# Altium schematic sheet Push-Pull_Inverter.SchDoc
size 1200 x 800 mm; SheetNumber: 1; SheetTotal: 1; SPICEModelCacheFSXMRDBX: <root> / <DocumentId>FSXMRDBX</DocumentId> / </root>
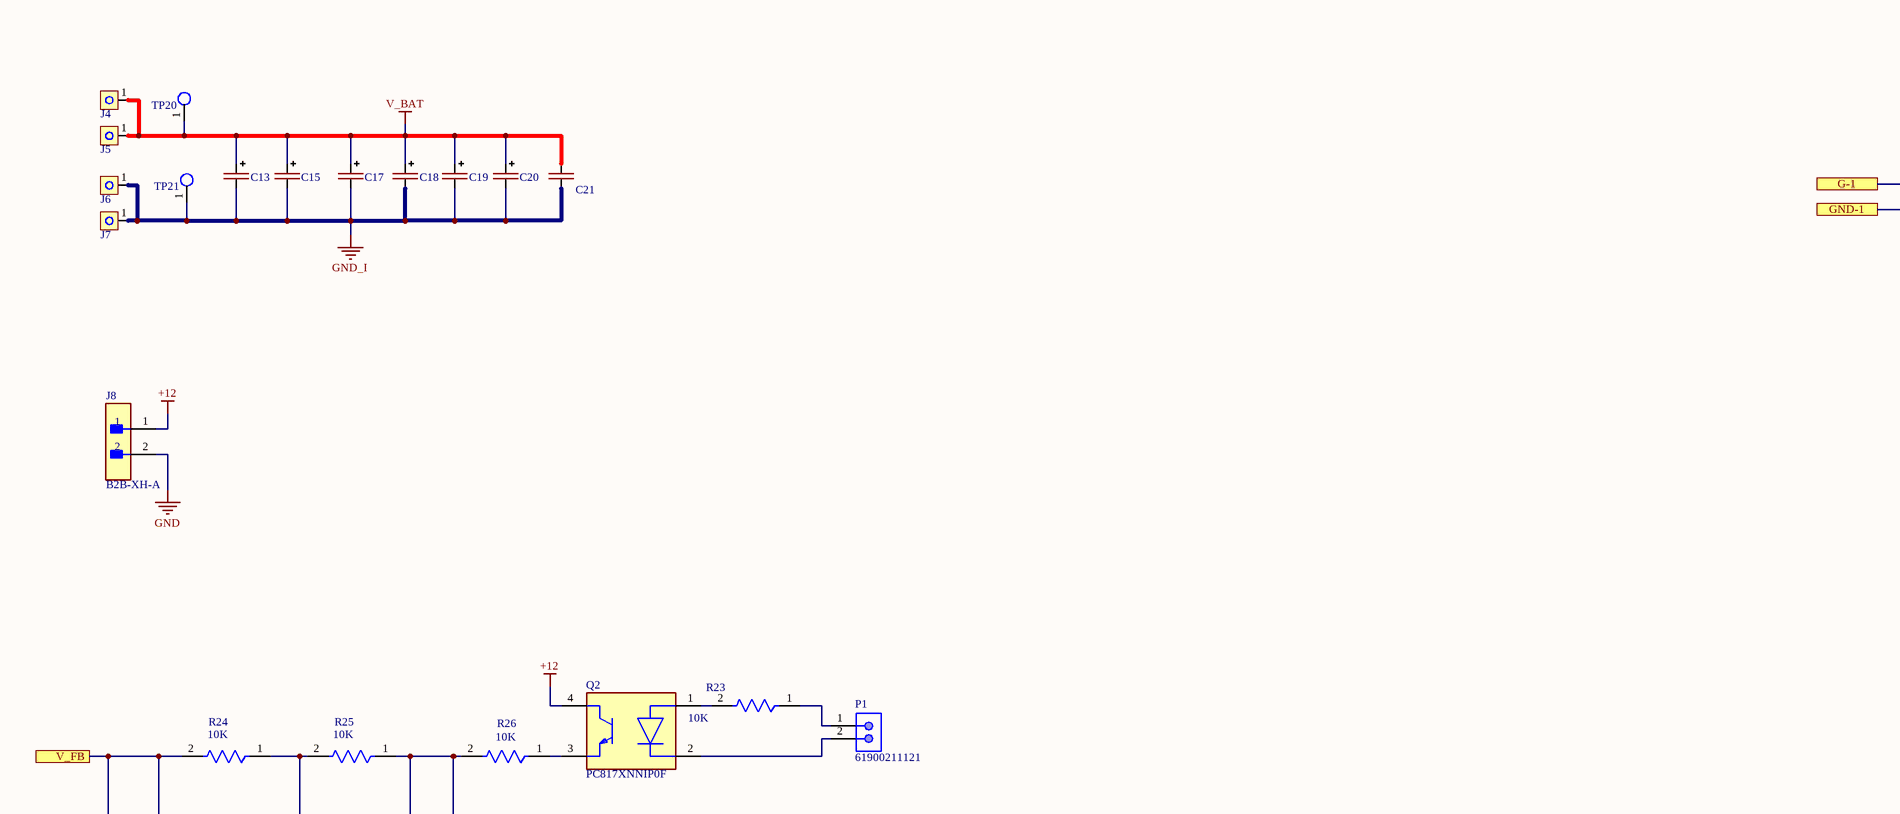
[diagram p0: Push-Pull_Inverter.SchDoc, top left]
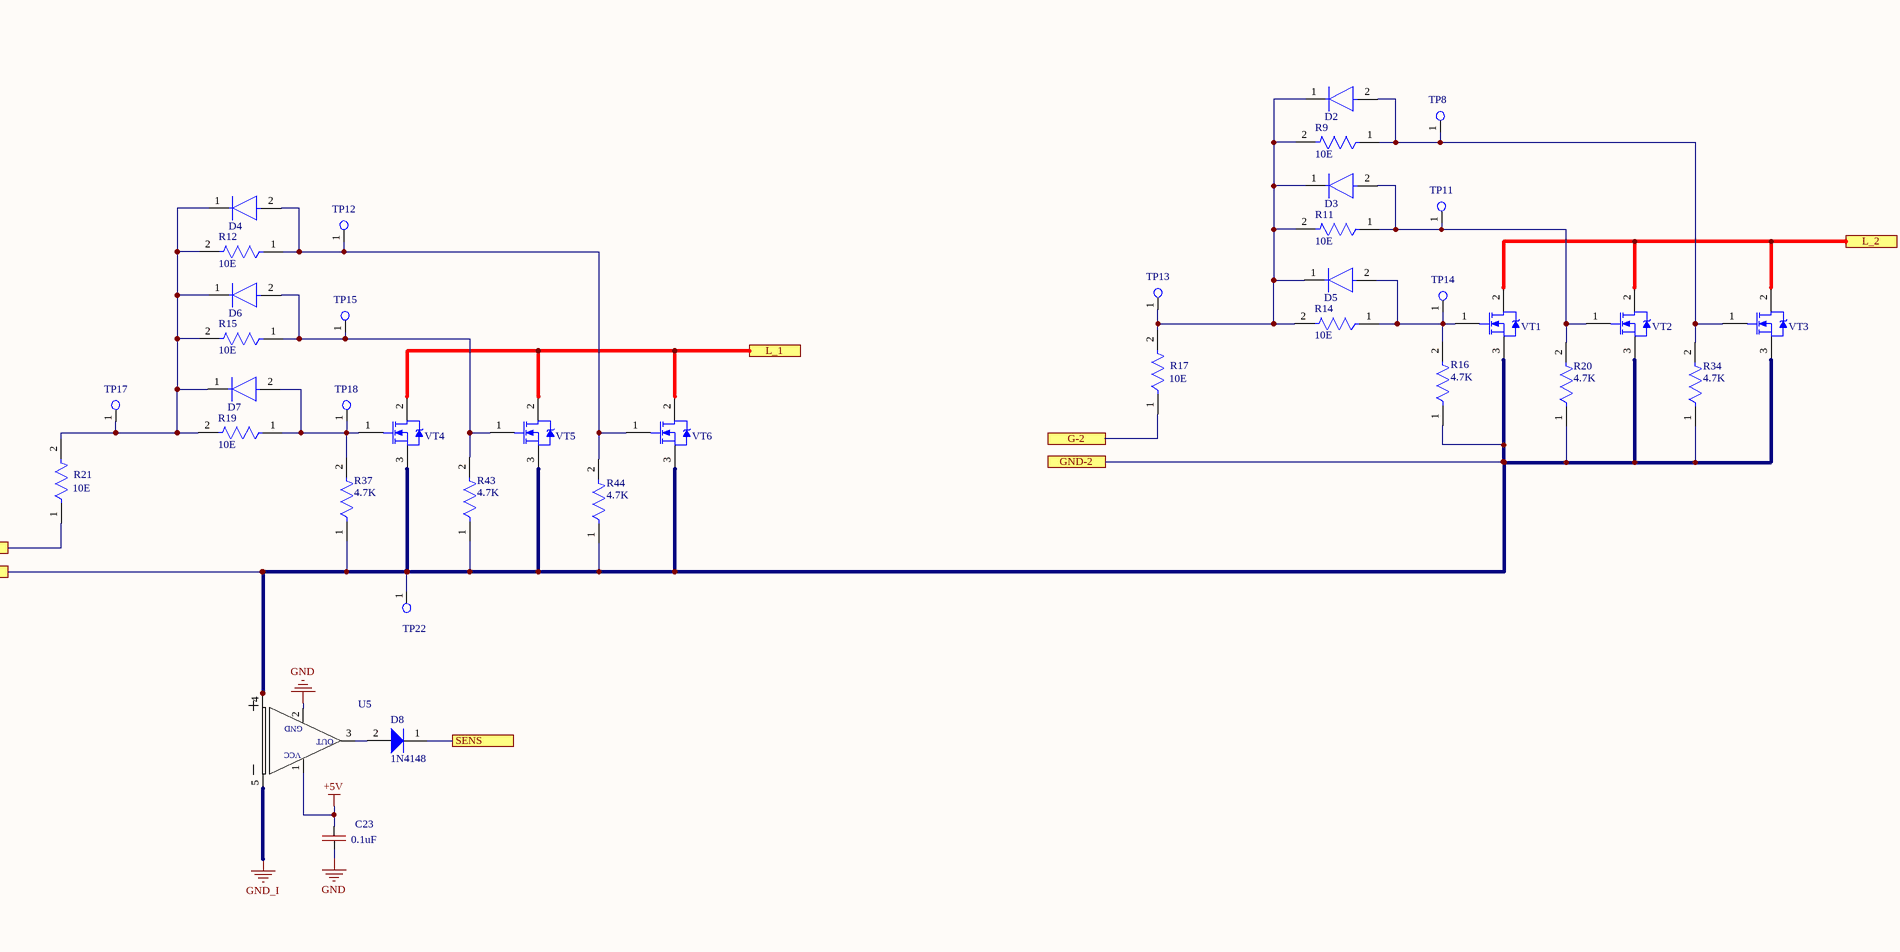
[diagram p1: Push-Pull_Inverter.SchDoc, top middle]
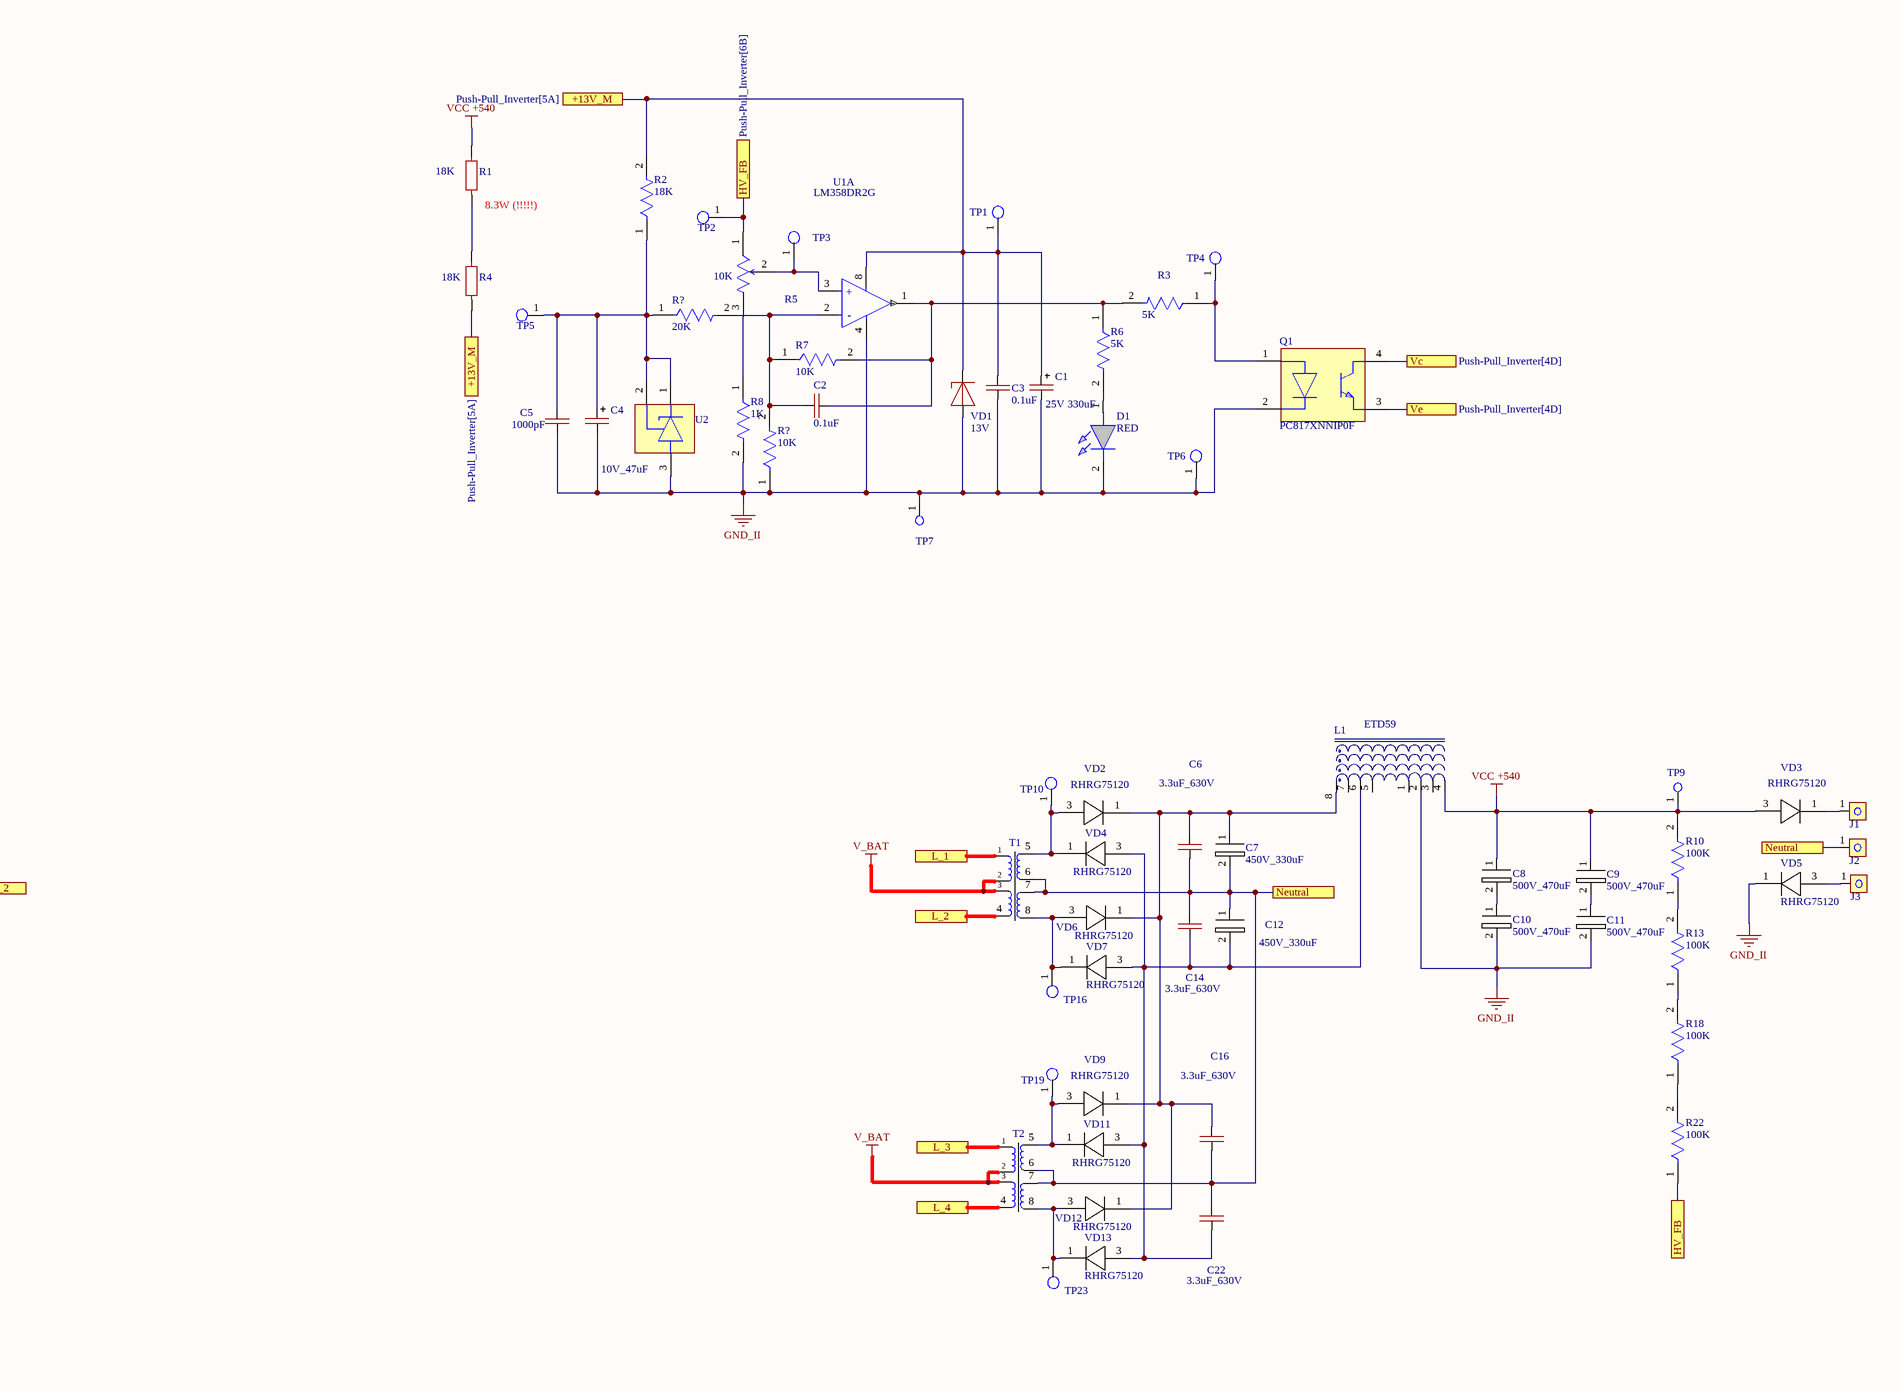
[diagram p2: Push-Pull_Inverter.SchDoc, top right]
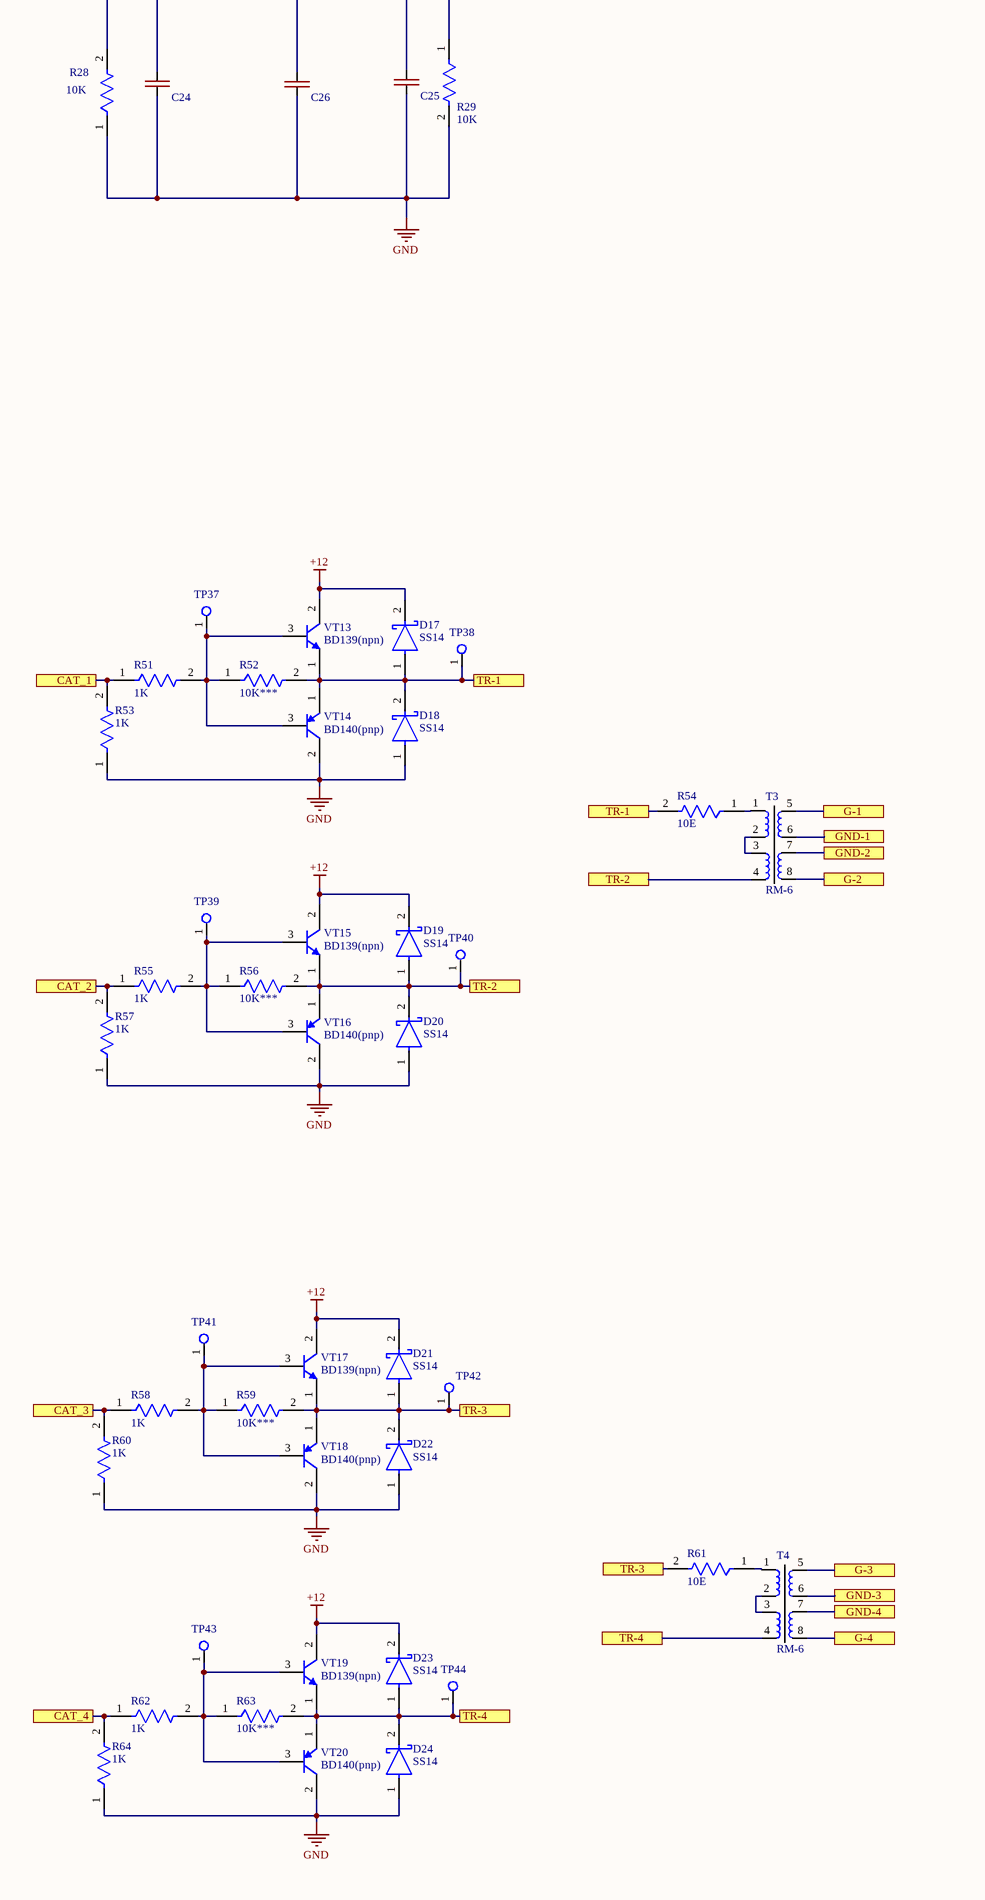
[diagram p3: Push-Pull_Inverter.SchDoc, bottom left]
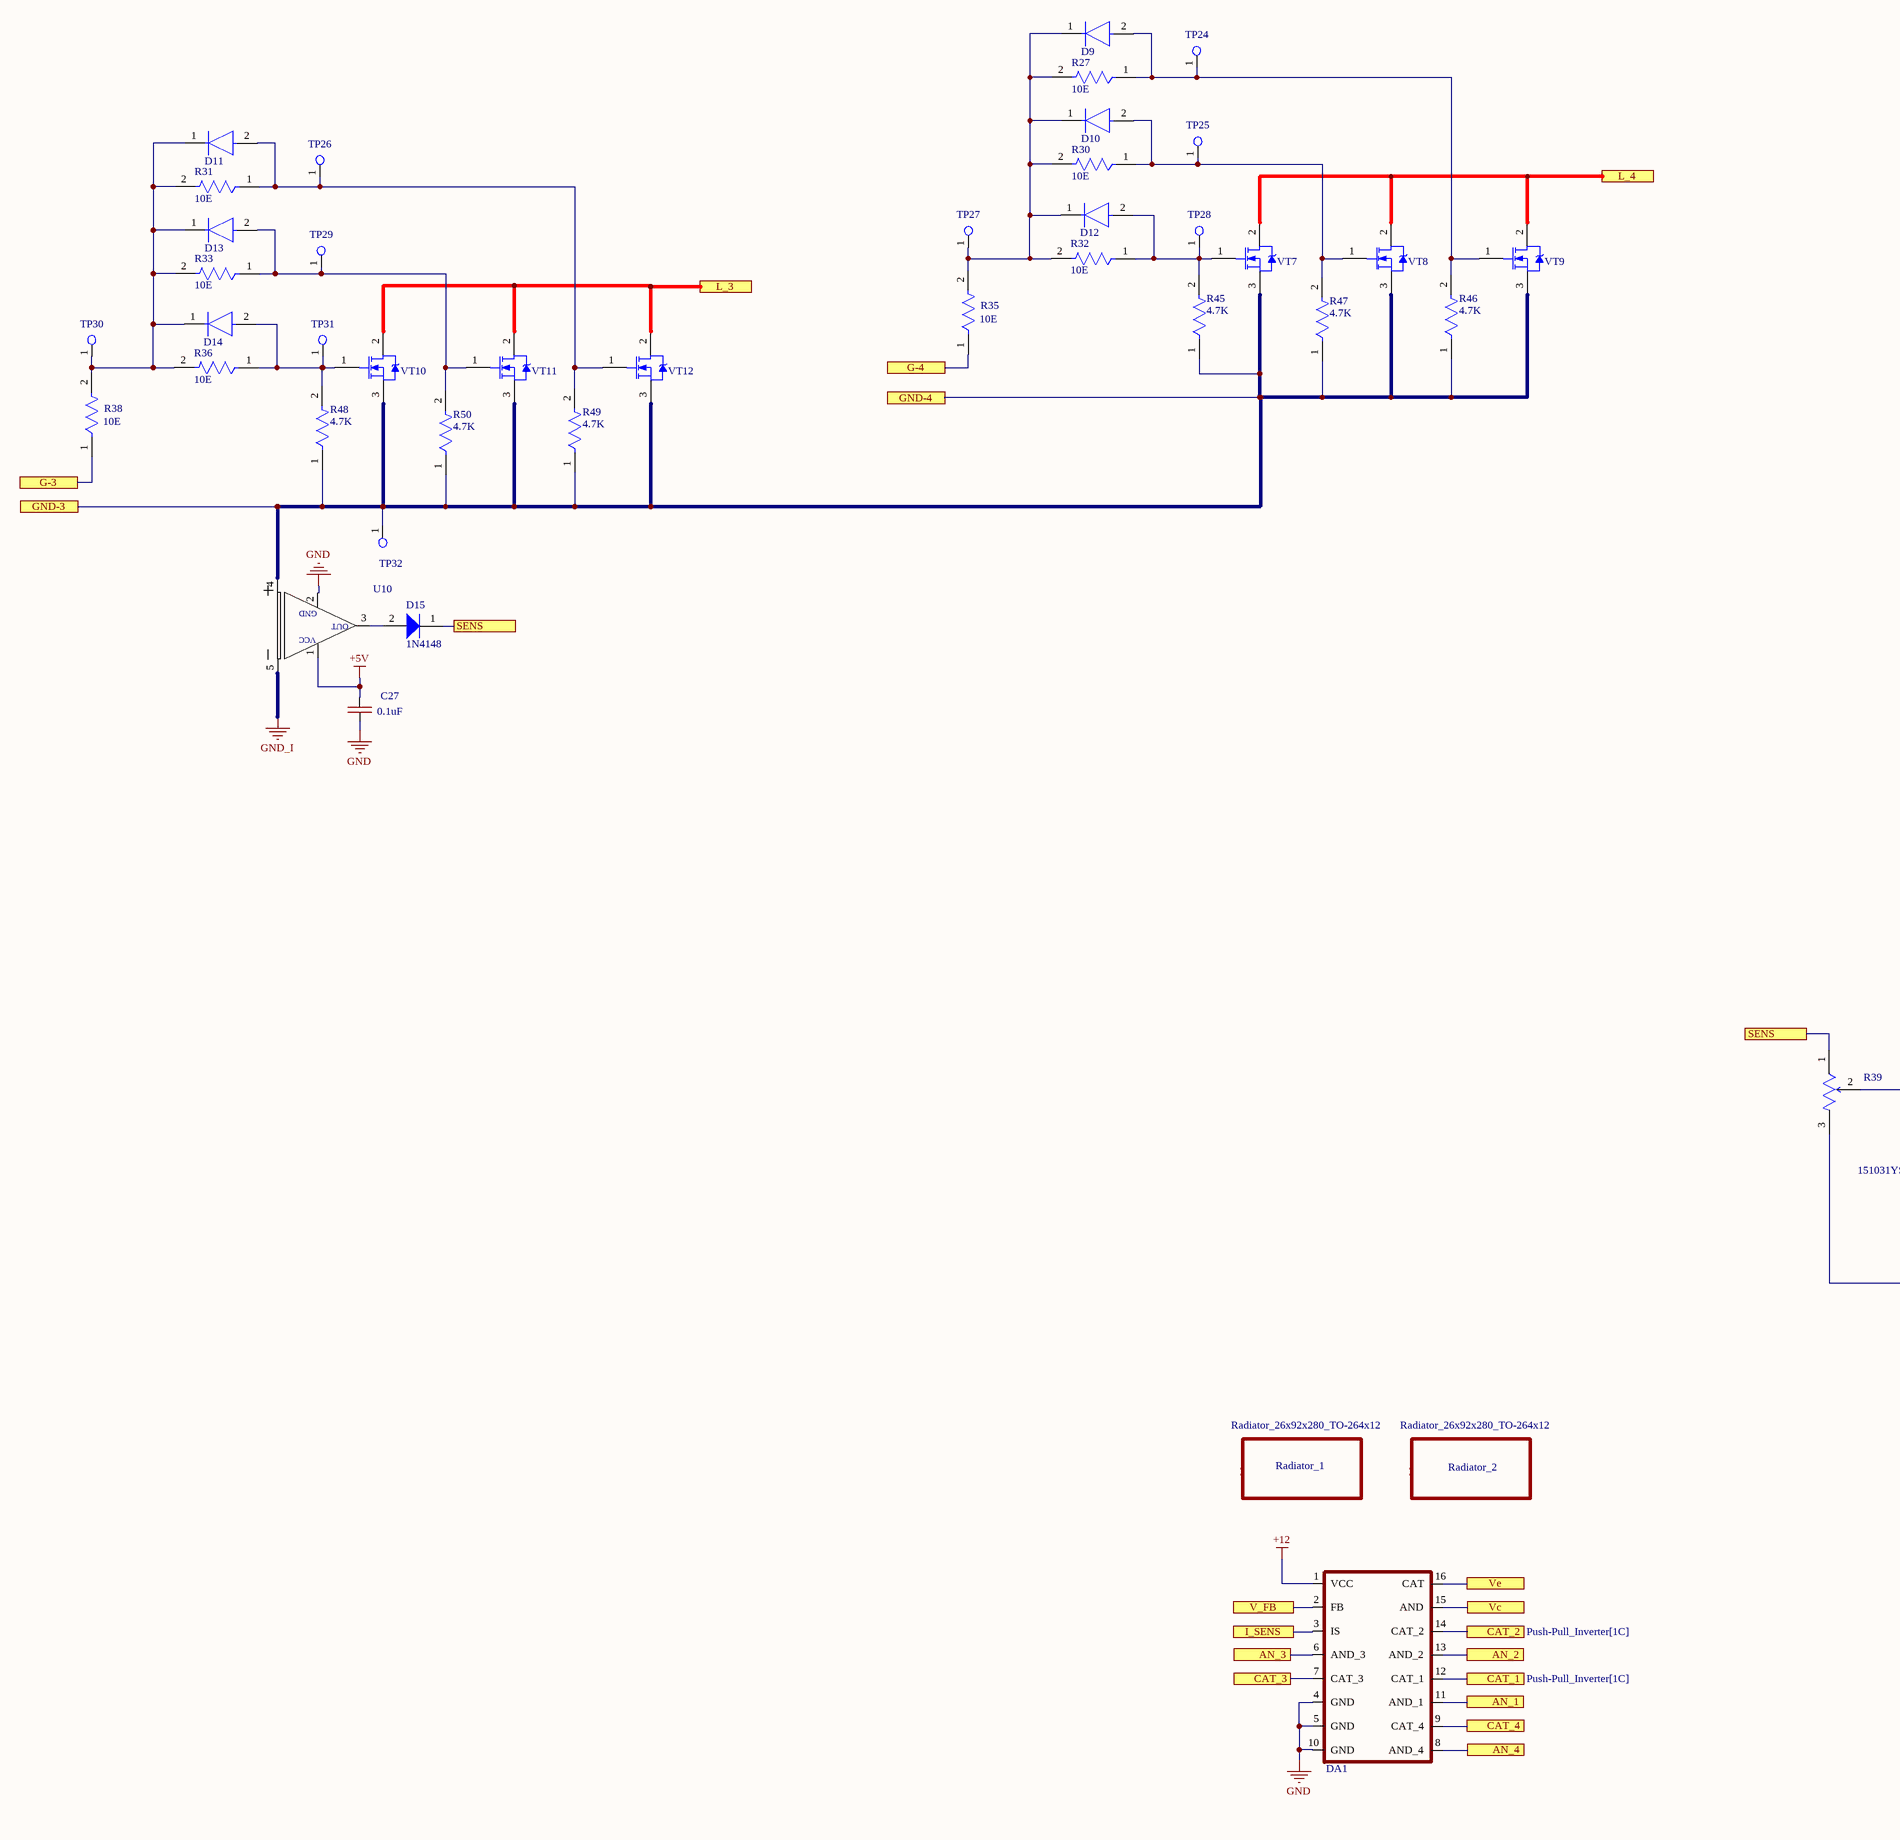
[diagram p4: Push-Pull_Inverter.SchDoc, bottom middle]
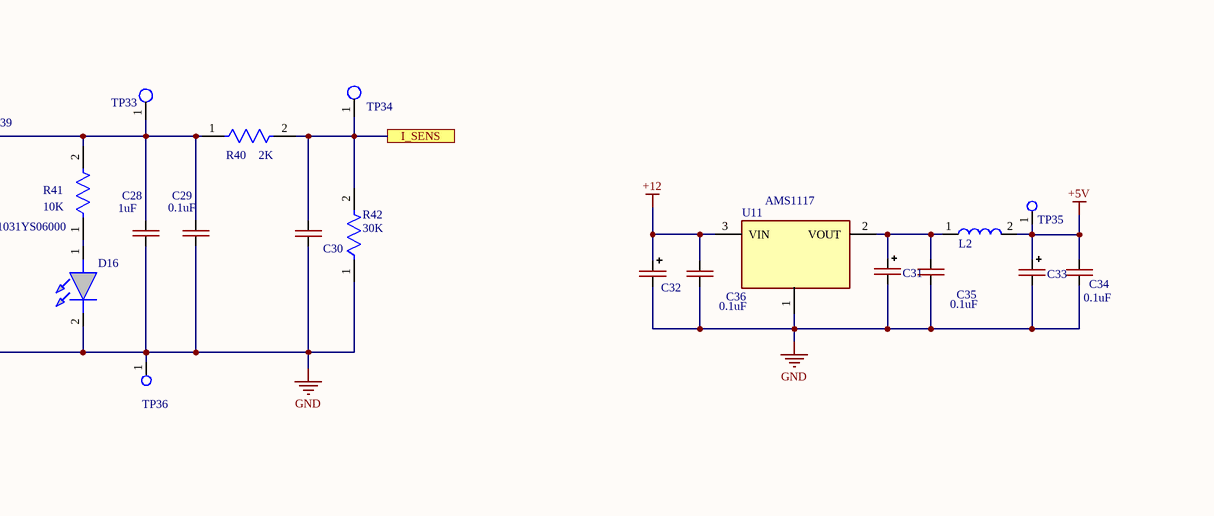
[diagram p5: Push-Pull_Inverter.SchDoc, bottom right]

## Parts
(Parts that share a designator on the sheet are numbered #1, #2 ... from top to bottom, then left to right.)
C1  25V 330uF  [CAP_SMD_Size_E]
C2  0.1uF  [CAP-0805]
C3  0.1uF  [CAP-0805]
C4  10V_47uF  [CAP-TAN-C]
C5  1000pF  [CAP-0805]
C6  3.3uF_630V  [CAP_4.7uF_630V]
C7  450V_330uF  [CAP_450V_330uF]
C8  500V_470uF  [CAP_450V_330uF]
C9  500V_470uF  [CAP_450V_330uF]
C10  500V_470uF  [CAP_450V_330uF]
C11  500V_470uF  [CAP_450V_330uF]
C12  450V_330uF  [CAP_450V_330uF]
C13  CAP-POLAR  [CAPPOL_35x60]  (value not drawn)
C14  3.3uF_630V  [CAP_4.7uF_630V]
C15  CAP-POLAR  [CAPPOL_35x60]  (value not drawn)
C16  3.3uF_630V  [CAP_4.7uF_630V]
C17  CAP-POLAR  [CAPPOL_35x60]  (value not drawn)
C18  CAP-POLAR  [CAPPOL_35x60]  (value not drawn)
C19  CAP-POLAR  [CAPPOL_35x60]  (value not drawn)
C20  CAP-POLAR  [CAPPOL_35x60]  (value not drawn)
C21  CAP-NON-POLAR  [CAP_1.5uf_400V]  (value not drawn)
C22  3.3uF_630V  [CAP_4.7uF_630V]
C23  0.1uF  [CAP-0805]
C24  CAP-NON-POLAR  [CAP-0805]  (value not drawn)
C25  CAP-NON-POLAR  [CAP-0805]  (value not drawn)
C26  CAP-NON-POLAR  [CAP-0805]  (value not drawn)
C27  0.1uF  [CAP-0805]
C28  1uF  [CAP-0805]
C29  0.1uF  [CAP-0805]
C30  CAP-NON-POLAR  [CAP-0805]  (value not drawn)
C31  CAP-POLAR  [CAP_SMD_Size_E]  (value not drawn)
C32  CAP-POLAR  [CAP_SMD_Size_E]  (value not drawn)
C33  CAP-POLAR  [CAP_SMD_Size_E]  (value not drawn)
C34  0.1uF  [CAP-0805]
C35  0.1uF  [CAP-0805]
C36  0.1uF  [CAP-0805]
D1  RED  [LED_RED]
D2  US1G  [DO-214AA]  (value not drawn)
D3  US1G  [DO-214AA]  (value not drawn)
D4  US1G  [DO-214AA]  (value not drawn)
D5  US1G  [DO-214AA]  (value not drawn)
D6  US1G  [DO-214AA]  (value not drawn)
D7  US1G  [DO-214AA]  (value not drawn)
D8  1N4148  [DIOD-SOD123-2_V]
D9  US1G  [DO-214AA]  (value not drawn)
D10  US1G  [DO-214AA]  (value not drawn)
D11  US1G  [DO-214AA]  (value not drawn)
D12  US1G  [DO-214AA]  (value not drawn)
D13  US1G  [DO-214AA]  (value not drawn)
D14  US1G  [DO-214AA]  (value not drawn)
D15  1N4148  [DIOD-SOD123-2_V]
D16  151031YS06000  [LED_RED]
D17  SS14  [DO-214-AC]
D18  SS14  [DO-214-AC]
D19  SS14  [DO-214-AC]
D20  SS14  [DO-214-AC]
D21  SS14  [DO-214-AC]
D22  SS14  [DO-214-AC]
D23  SS14  [DO-214-AC]
D24  SS14  [DO-214-AC]
DA1  PWM_Controller_Half_Bridge_ONLY_TL494  [PWM_Controller_Half_Bridge_ONLY_TL494]  (value not drawn)
J1  MG_136_HT  [Conn_MEIGAN_MG136HT]  (value not drawn)
J2  MG_136_HT  [Conn_MEIGAN_MG136HT]  (value not drawn)
J3  MG_136_HT  [Conn_MEIGAN_MG136HT]  (value not drawn)
J4  MG_136_HT  [Conn_MEIGAN_MG136HT]  (value not drawn)
J5  MG_136_HT  [Conn_MEIGAN_MG136HT]  (value not drawn)
J6  MG_136_HT  [Conn_MEIGAN_MG136HT]  (value not drawn)
J7  MG_136_HT  [Conn_MEIGAN_MG136HT]  (value not drawn)
J8  B2B-XH-A  [B2B-XH-A]
L1  ETD59  [Drossel]
L2  Coil  [Coil_4.5x4.5_mm]  (value not drawn)
P1  61900211121  [61900211121]
Q1  PC817XNNIP0F  [FP-PC817XNNIP0F-MFG]
Q2  PC817XNNIP0F  [FP-PC817XNNIP0F-MFG]
R1  18K  [RES_5W_VERT]
R2  18K  [RES-0805]
R3  5K  [RES-0805]
R4  18K  [RES_5W_VERT]
R5  10K  [RES_Adj_3296W_Bourns]
R6  5K  [RES-0805]
R7  10K  [RES-0805]
R8  1K  [RES-0805]
R9  10E  [RES_SMD_1210_IPC_A]
R10  100K  [RES-0805]
R11  10E  [RES_SMD_1210_IPC_A]
R12  10E  [RES_SMD_1210_IPC_A]
R13  100K  [RES-0805]
R14  10E  [RES_SMD_1210_IPC_A]
R15  10E  [RES_SMD_1210_IPC_A]
R16  4.7K  [RES-0805]
R17  10E  [RES_SMD_1210_IPC_A]
R18  100K  [RES-0805]
R19  10E  [RES_SMD_1210_IPC_A]
R20  4.7K  [RES-0805]
R21  10E  [RES_SMD_1210_IPC_A]
R22  100K  [RES-0805]
R23  10K  [RES-0805]
R24  10K  [RES-0805]
R25  10K  [RES-0805]
R26  10K  [RES-0805]
R27  10E  [RES_SMD_1210_IPC_A]
R28  10K  [RES-0805]
R29  10K  [RES-0805]
R30  10E  [RES_SMD_1210_IPC_A]
R31  10E  [RES_SMD_1210_IPC_A]
R32  10E  [RES_SMD_1210_IPC_A]
R33  10E  [RES_SMD_1210_IPC_A]
R34  4.7K  [RES-0805]
R35  10E  [RES_SMD_1210_IPC_A]
R36  10E  [RES_SMD_1210_IPC_A]
R37  4.7K  [RES-0805]
R38  10E  [RES_SMD_1210_IPC_A]
R39  10K  [RES_Adj_3296W_Bourns]  (value not drawn)
R40  2K  [RES-0805]
R41  10K  [RES-0805]
R42  30K  [RES-0805]
R43  4.7K  [RES-0805]
R44  4.7K  [RES-0805]
R45  4.7K  [RES-0805]
R46  4.7K  [RES-0805]
R47  4.7K  [RES-0805]
R48  4.7K  [RES-0805]
R49  4.7K  [RES-0805]
R50  4.7K  [RES-0805]
R51  1K  [RES-0805]
R52  10K***  [RES-0805]
R53  1K  [RES-0805]
R54  10E  [RES_SMD_1210_IPC_A]
R55  1K  [RES-0805]
R56  10K***  [RES-0805]
R57  1K  [RES-0805]
R58  1K  [RES-0805]
R59  10K***  [RES-0805]
R60  1K  [RES-0805]
R61  10E  [RES_SMD_1210_IPC_A]
R62  1K  [RES-0805]
R63  10K***  [RES-0805]
R64  1K  [RES-0805]
R?#1  20K  [RES-0805]
R?#2  10K  [RES-0805]
Radiator_1  Radiator_26х92х280_ТО-264х12  [Radiator_26х92х280_ТО-264х12]  (value not drawn)
Radiator_2  Radiator_26х92х280_ТО-264х12  [Radiator_26х92х280_ТО-264х12]  (value not drawn)
T1  Transformer_IV  [EE84AA Hor]  (value not drawn)
T2  Transformer_IV  [EE84AA Hor]  (value not drawn)
T3  RM-6  [TRANS_RM6]
T4  RM-6  [TRANS_RM6]
TP1  Test_Point_PCB  [Test_Point]  (value not drawn)
TP2  Test_Point_PCB  [Test_Point]  (value not drawn)
TP3  Test_Point_PCB  [Test_Point]  (value not drawn)
TP4  Test_Point_PCB  [Test_Point]  (value not drawn)
TP5  Test_Point_PCB  [Test_Point]  (value not drawn)
TP6  Test_Point_PCB  [Test_Point]  (value not drawn)
TP7  Test_Point_PCB  [Pin_Test_Point(Pink)]  (value not drawn)
TP8  Test_Point_PCB  [Test_Point]  (value not drawn)
TP9  Test_Point_PCB  [Test_Point]  (value not drawn)
TP10  Test_Point_PCB  [Test_Point]  (value not drawn)
TP11  Test_Point_PCB  [Test_Point]  (value not drawn)
TP12  Test_Point_PCB  [Test_Point]  (value not drawn)
TP13  Test_Point_PCB  [Test_Point]  (value not drawn)
TP14  Test_Point_PCB  [Test_Point]  (value not drawn)
TP15  Test_Point_PCB  [Test_Point]  (value not drawn)
TP16  Test_Point_PCB  [Test_Point]  (value not drawn)
TP17  Test_Point_PCB  [Test_Point]  (value not drawn)
TP18  Test_Point_PCB  [Test_Point]  (value not drawn)
TP19  Test_Point_PCB  [Test_Point]  (value not drawn)
TP20  (no value)  [Test_Point]
TP21  Test_Point_PCB  [Test_Point]  (value not drawn)
TP22  Test_Point_PCB  [Pin_Test_Point(Orange)]  (value not drawn)
TP23  Test_Point_PCB  [Test_Point]  (value not drawn)
TP24  Test_Point_PCB  [Test_Point]  (value not drawn)
TP25  Test_Point_PCB  [Test_Point]  (value not drawn)
TP26  Test_Point_PCB  [Test_Point]  (value not drawn)
TP27  Test_Point_PCB  [Test_Point]  (value not drawn)
TP28  Test_Point_PCB  [Test_Point]  (value not drawn)
TP29  Test_Point_PCB  [Test_Point]  (value not drawn)
TP30  Test_Point_PCB  [Test_Point]  (value not drawn)
TP31  Test_Point_PCB  [Test_Point]  (value not drawn)
TP32  Test_Point_PCB  [Pin_Test_Point(Orange)]  (value not drawn)
TP33  Test_Point_PCB  [Test_Point]  (value not drawn)
TP34  (no value)  [Test_Point]
TP35  Test_Point_PCB  [Test_Point]  (value not drawn)
TP36  Test_Point_PCB  [Pin_Test_Point(Orange)]  (value not drawn)
TP37  Test_Point_PCB  [Test_Point]  (value not drawn)
TP38  Test_Point_PCB  [Test_Point]  (value not drawn)
TP39  Test_Point_PCB  [Test_Point]  (value not drawn)
TP40  Test_Point_PCB  [Test_Point]  (value not drawn)
TP41  Test_Point_PCB  [Test_Point]  (value not drawn)
TP42  Test_Point_PCB  [Test_Point]  (value not drawn)
TP43  Test_Point_PCB  [Test_Point]  (value not drawn)
TP44  Test_Point_PCB  [Test_Point]  (value not drawn)
U1  LM358DR2G  [FP-751-07-IPC_C]  (part A of 2)
U2  (no value)  [TL431_SOT-23-3(A)]
U5  ACS758  [ACS758-100]  (value not drawn)
U10  ACS758  [ACS758-100]  (value not drawn)
U11  AMS1117  [SOT-223]
VD1  13V  [DO-017AA]
VD2  RHRG75120  [TO-247-2]
VD3  RHRG75120  [TO-247-2]
VD4  RHRG75120  [TO-247-2]
VD5  RHRG75120  [TO-247-2]
VD6  RHRG75120  [TO-247-2]
VD7  RHRG75120  [TO-247-2]
VD9  RHRG75120  [TO-247-2]
VD11  RHRG75120  [TO-247-2]
VD12  RHRG75120  [TO-247-2]
VD13  RHRG75120  [TO-247-2]
VT1  SPW47N60  [TO-247-3(Infineon)]  (value not drawn)
VT2  SPW47N60  [TO-247-3(Infineon)]  (value not drawn)
VT3  SPW47N60  [TO-247-3(Infineon)]  (value not drawn)
VT4  SPW47N60  [TO-247-3(Infineon)]  (value not drawn)
VT5  SPW47N60  [TO-247-3(Infineon)]  (value not drawn)
VT6  SPW47N60  [TO-247-3(Infineon)]  (value not drawn)
VT7  SPW47N60  [TO-247-3(Infineon)]  (value not drawn)
VT8  SPW47N60  [TO-247-3(Infineon)]  (value not drawn)
VT9  SPW47N60  [TO-247-3(Infineon)]  (value not drawn)
VT10  SPW47N60  [TO-247-3(Infineon)]  (value not drawn)
VT11  SPW47N60  [TO-247-3(Infineon)]  (value not drawn)
VT12  SPW47N60  [TO-247-3(Infineon)]  (value not drawn)
VT13  BD139(npn)  [TO-126]
VT14  BD140(pnp)  [TO-126]
VT15  BD139(npn)  [TO-126]
VT16  BD140(pnp)  [TO-126]
VT17  BD139(npn)  [TO-126]
VT18  BD140(pnp)  [TO-126]
VT19  BD139(npn)  [TO-126]
VT20  BD140(pnp)  [TO-126]

## Ports
+13V_M (see Push-Pull_Inverter[5A]), AN_1, AN_2, AN_3, AN_4, CAT_1 (see Push-Pull_Inverter[1C]), CAT_1 (see Push-Pull_Inverter[4D]), CAT_2 (see Push-Pull_Inverter[1C]), CAT_2 (see Push-Pull_Inverter[4D]), CAT_3 (see Push-Pull_Inverter[1D]), CAT_3 (see Push-Pull_Inverter[4D]), CAT_4 (see Push-Pull_Inverter[1D]), CAT_4 (see Push-Pull_Inverter[4D]), G-1 (see Push-Pull_Inverter[1C]), G-1 (see Push-Pull_Inverter[2B]), G-2 (see Push-Pull_Inverter[1C]), G-2 (see Push-Pull_Inverter[4B]), G-3 (see Push-Pull_Inverter[1D]), G-3 (see Push-Pull_Inverter[3C]), G-4 (see Push-Pull_Inverter[1D]), G-4 (see Push-Pull_Inverter[3C]), GND-1 (see Push-Pull_Inverter[1C]), GND-1 (see Push-Pull_Inverter[2B]), GND-2 (see Push-Pull_Inverter[1C]), GND-2 (see Push-Pull_Inverter[4B]), GND-3 (see Push-Pull_Inverter[1D]), GND-3 (see Push-Pull_Inverter[3C]), GND-4 (see Push-Pull_Inverter[1D]), GND-4 (see Push-Pull_Inverter[3C]), HV_FB (see Push-Pull_Inverter[5A]), HV_FB (see Push-Pull_Inverter[6B]), I_SENS (see Push-Pull_Inverter[4D]), I_SENS (see Push-Pull_Inverter[5D]), L_1 (see Push-Pull_Inverter[3B]), L_1 (see Push-Pull_Inverter[5A]), L_2 (see Push-Pull_Inverter[4A]), L_2 (see Push-Pull_Inverter[5A]), L_3 (see Push-Pull_Inverter[3C]), L_3 (see Push-Pull_Inverter[5B]), L_4 (see Push-Pull_Inverter[4C]), L_4 (see Push-Pull_Inverter[5B]), Neutral (see Push-Pull_Inverter[6A]), SENS (see Push-Pull_Inverter[3B], Push-Pull_Inverter[3C]), SENS (see Push-Pull_Inverter[3B], Push-Pull_Inverter[4C]), SENS (see Push-Pull_Inverter[3C], Push-Pull_Inverter[4C]), TR-1 (see Push-Pull_Inverter[1C]), TR-2 (see Push-Pull_Inverter[1C]), TR-3 (see Push-Pull_Inverter[1D]), TR-4 (see Push-Pull_Inverter[1D]), V_FB (see Push-Pull_Inverter[1B]), V_FB (see Push-Pull_Inverter[4D]), Vc (see Push-Pull_Inverter[4D]), Vc (see Push-Pull_Inverter[6A]), Ve (see Push-Pull_Inverter[4D]), Ve (see Push-Pull_Inverter[6A])

## Nets
+5V: C23.2 C27.2 C33.1(+) C34.2 L2.2 TP35.1(G9) U5.1(+VCC) U10.1(+VCC)
+12: C32.1(+) C36.2 D17.2(C) D19.2(C) D21.2(C) D23.2(C) DA1.1(VCC) J8.1 Q2.4(C) U11.3(VIN) VT13.2(C) VT15.2(C) VT17.2(C) VT19.2(C)
GND: C23.1 C24.1 C25.1 C26.1 C27.1 C28.2 C29.2 C30.1 C31.2(-) C32.2(-) C33.2(-) C34.1 C35.1 C36.1 D16.2(K) D18.1(A) D20.1(A) D22.1(A) D24.1(A) DA1.4(GND) DA1.5(GND) DA1.10(GND) J8.2 R28.1 R29.2 R39.3(CW) R42.1 R53.1 R57.1 R60.1 R64.1 TP36.1(G9) U5.2(GND) U10.2(GND) U11.1(Ground) VT14.2(C) VT16.2(C) VT18.2(C) VT20.2(C)
GND_I: C13.2(-) C15.2(-) C17.2(-) C18.2(-) C19.2(-) C20.2(-) C21.1 J6.1 J7.1 TP21.1(G9) U5.5(-IP) U10.5(-IP)
GND_II: C1.2(-) C3.1 C4.2(-) C5.2 C10.2 C11.2 D1.2(K) L1.2 Q1.2(C) R8.2 R?#2.1 TP6.1(G9) TP7.1(G9) U1.4(VEE/GND) U2.3(A) VD1.2(A) VD5.1
V_BAT: C13.1(+) C15.1(+) C17.1(+) C18.1(+) C19.1(+) C20.1(+) C21.2 J4.1 J5.1 T1.2 T1.3 T2.2 T2.3 TP20.1(G9)
VCC +540: C8.1 C9.1 L1.4 R1.2 R10.2 TP9.1(G9) VD3.3
+13V_M: C1.1(+) C3.2 R2.2 R4.1 TP1.1(G9) U1.8(VCC) VD1.1(C) ; port +13V_M
AN_1: DA1.11(AND_1) ; port AN_1
AN_2: DA1.13(AND_2) ; port AN_2
AN_3: DA1.6(AND_3) ; port AN_3
AN_4: DA1.8(AND_4) ; port AN_4
CAT_1: DA1.12(CAT_1) R51.1 R53.2 ; port CAT_1
CAT_2: DA1.14(CAT_2) R55.1 R57.2 ; port CAT_2
CAT_3: DA1.7(CAT_3) R58.1 R60.2 ; port CAT_3
CAT_4: DA1.9(CAT_4) R62.1 R64.2 ; port CAT_4
G-1: R21.1 T3.5 ; port G-1
G-2: R17.1 T3.8 ; port G-2
G-3: R38.1 T4.5 ; port G-3
G-4: R35.1 T4.8 ; port G-4
GND-1: R16.1 R20.1 R34.1 R37.1 R43.1 R44.1 T3.6 T3.7 TP22.1(G9) U5.4(+IP) VT1.3(SOURCE) VT2.3(SOURCE) VT3.3(SOURCE) VT4.3(SOURCE) VT5.3(SOURCE) VT6.3(SOURCE) ; port GND-1, port GND-2
GND-3: R45.1 R46.1 R47.1 R48.1 R49.1 R50.1 T4.6 T4.7 TP32.1(G9) U10.4(+IP) VT7.3(SOURCE) VT8.3(SOURCE) VT9.3(SOURCE) VT10.3(SOURCE) VT11.3(SOURCE) VT12.3(SOURCE) ; port GND-3, port GND-4
HV_FB: R5.1(CCW) R22.1 TP2.1(G9) ; port HV_FB
I_SENS: C30.2 DA1.3(IS) R40.2 R42.2 TP34.1(G9) ; port I_SENS
L_1: T1.1 VT4.2(DRAIN) VT5.2(DRAIN) VT6.2(DRAIN) ; port L_1
L_2: T1.4 VT1.2(DRAIN) VT2.2(DRAIN) VT3.2(DRAIN) ; port L_2
L_3: T2.1 VT10.2(DRAIN) VT11.2(DRAIN) VT12.2(DRAIN) ; port L_3
L_4: T2.4 VT7.2(DRAIN) VT8.2(DRAIN) VT9.2(DRAIN) ; port L_4
Neutral: C6.1 C7.2 C12.1 C14.2 C16.1 C22.2 J2.1 T1.6 T1.7 T2.6 T2.7 ; port Neutral
SENS: D8.1(K) D15.1(K) R39.1(CCW) ; port SENS
TR-1: D17.1(A) D18.2(C) R52.2 R54.2 TP38.1(G9) VT13.1(E) VT14.1(E) ; port TR-1
TR-2: D19.1(A) D20.2(C) R56.2 T3.4 TP40.1(G9) VT15.1(E) VT16.1(E) ; port TR-2
TR-3: D21.1(A) D22.2(C) R59.2 R61.2 TP42.1(G9) VT17.1(E) VT18.1(E) ; port TR-3
TR-4: D23.1(A) D24.2(C) R63.2 T4.4 TP44.1(G9) VT19.1(E) VT20.1(E) ; port TR-4
V_FB: C24.2 DA1.2(FB) R24.2 R28.2 ; port V_FB
Vc: DA1.15(AND) Q1.4(C) ; port Vc
Ve: DA1.16(CAT) Q1.3(E) ; port Ve
NetC2_1: C2.1 R3.2 R6.1 R7.2 U1.1(OUTPUT_A)
NetC2_2: C2.2 R7.1 R?#1.2 R?#2.2 U1.2(INPUT_A-)
NetC4_1: C4.1(+) C5.1 R2.1 R?#1.1 TP5.1(G9) U2.1(C) U2.2(REF)
NetC6_2: C6.2 C7.1 C16.2 L1.8 VD2.1 VD6.1 VD9.1 VD12.1
NetC8_2: C8.2 C10.1
NetC9_2: C9.2 C11.1
NetC12_2: C12.2 C14.1 C22.1 L1.6 VD4.3 VD7.3 VD11.3 VD13.3
NetC25_2: C25.2 R25.1 R26.2 R29.1
NetC26_2: C26.2 R24.1 R25.2
NetC28_1: C28.1 C29.1 R39.2(WIPER) R40.1 R41.2 TP33.1(G9)
NetC31_1: C31.1(+) C35.2 L2.1 U11.2(VOUT)
NetD1_1: D1.1(A) R6.2
NetD2_1: D2.1(C) D3.1(C) D5.1(C) R9.2 R11.2 R14.2 R17.2 TP13.1(G9)
NetD2_2: D2.2(A) R9.1 R34.2 TP8.1(G9) VT3.1(GATE)
NetD3_2: D3.2(A) R11.1 R20.2 TP11.1(G9) VT2.1(GATE)
NetD4_1: D4.1(C) D6.1(C) D7.1(C) R12.2 R15.2 R19.2 R21.2 TP17.1(G9)
NetD4_2: D4.2(A) R12.1 R44.2 TP12.1(G9) VT6.1(GATE)
NetD5_2: D5.2(A) R14.1 R16.2 TP14.1(G9) VT1.1(GATE)
NetD6_2: D6.2(A) R15.1 R43.2 TP15.1(G9) VT5.1(GATE)
NetD7_2: D7.2(A) R19.1 R37.2 TP18.1(G9) VT4.1(GATE)
NetD8_2: D8.2(A) U5.3(OUT)
NetD9_1: D9.1(C) D10.1(C) D12.1(C) R27.2 R30.2 R32.2 R35.2 TP27.1(G9)
NetD9_2: D9.2(A) R27.1 R46.2 TP24.1(G9) VT9.1(GATE)
NetD10_2: D10.2(A) R30.1 R47.2 TP25.1(G9) VT8.1(GATE)
NetD11_1: D11.1(C) D13.1(C) D14.1(C) R31.2 R33.2 R36.2 R38.2 TP30.1(G9)
NetD11_2: D11.2(A) R31.1 R49.2 TP26.1(G9) VT12.1(GATE)
NetD12_2: D12.2(A) R32.1 R45.2 TP28.1(G9) VT7.1(GATE)
NetD13_2: D13.2(A) R33.1 R50.2 TP29.1(G9) VT11.1(GATE)
NetD14_2: D14.2(A) R36.1 R48.2 TP31.1(G9) VT10.1(GATE)
NetD15_2: D15.2(A) U10.3(OUT)
NetD16_1: D16.1(A) R41.1
NetJ1_1: J1.1 VD3.1
NetJ3_1: J3.1 VD5.3
NetP1_1: P1.1 R23.1
NetP1_2: P1.2 Q2.2(C)
NetQ1_1: Q1.1(A) R3.1 TP4.1(G9)
NetQ2_1: Q2.1(A) R23.2
NetQ2_3: Q2.3(E) R26.1
NetR1_1: R1.1 R4.2
NetR5_2: R5.2(WIPER) TP3.1(G9) U1.3(INPUT_A+)
NetR5_3: R5.3(CW) R8.1
NetR10_1: R10.1 R13.2
NetR13_1: R13.1 R18.2
NetR18_1: R18.1 R22.2
NetR51_2: R51.2 R52.1 TP37.1(G9) VT13.3(B) VT14.3(B)
NetR54_1: R54.1 T3.1
NetR55_2: R55.2 R56.1 TP39.1(G9) VT15.3(B) VT16.3(B)
NetR58_2: R58.2 R59.1 TP41.1(G9) VT17.3(B) VT18.3(B)
NetR61_1: R61.1 T4.1
NetR62_2: R62.2 R63.1 TP43.1(G9) VT19.3(B) VT20.3(B)
NetT1_5: T1.5 TP10.1(G9) VD2.3 VD4.1
NetT1_8: T1.8 TP16.1(G9) VD6.3 VD7.1
NetT2_5: T2.5 TP19.1(G9) VD9.3 VD11.1
NetT2_8: T2.8 TP23.1(G9) VD12.3 VD13.1
NetT3_2: T3.2 T3.3
NetT4_2: T4.2 T4.3

Not connected (* = marked no-connect by the designer): L1 1 3 5 7

## Notes on the sheet
- (near R1) 8.3W (!!!!!)
- (in symbol ACS758) VCC
- (in symbol CMP-1310-00291-2, part A) +; -

## Library data of the parts
C1 C4 = CAP_POL_SMD
C2 C3 C5 C6 C14 C16 C22 C23 C27-C29 C34-C36 = CAP-NON-POLAR
C7-C12 = CAP_450V_330uF
D1 D16 = LED: WURTH ELEKTRONIK - 151031YS06000 - LED, Yellow, Through Hole, T-1 (3mm), 30 mA, 2 V, 590 nm; Geometry.Height: 5.5mm; Manufacturer_Name: Wurth Elektronik; Manufacturer_Part_Number: 151031YS06000; Mouser Part Number: 710-151031YS06000; Mouser Price/Stock: https://www.mouser.co.uk/ProductDetail/Wurth-Elektronik/151031YS06000?qs=LlUlMxKIyB3xSYYW%252BcuBiQ%3D%3D; Arrow Part Number: *; Arrow Price/Stock: *; Mouser Testing Part Number: *; Mouser Testing Price/Stock: *; Datasheet Link: https://katalog.we-online.de/led/datasheet/151031YS06000.pdf
J1-J7 = Connector_MEIGAN_MG136HT
L1 = DROSSEL: Drosel; PartNumber: 750311457; Manufacturer: Wuerth Elektronik; Ui: 36V; ComponentLink1Description: Manufacturer URL; ComponentLink2Description: Datasheet; ComponentLink1URL: http://www.we-online.com; PackageReference: EP13; ComponentLink2URL: http://katalog.we-online.de/pbs/datasheet/750311457.pdf
P1 = 61900211121: WR-WTB THT Male Vertical Locking Header, pitch 2.54mm, 2p; Pin Number: 2; Contact Resistance: 20mOhm; Rated Current: 3A; Withstanding Voltage: 1000VAC; Working Voltage: 250VAC; ComponentLink1Description: Manufacturer; ComponentLink1URL: http://www.we-online.de; ComponentLink2Description: Datasheet; ComponentLink2URL: https://www.we-online.com/catalog/datasheet/61900211121.pdf; Pitch: 2.54mm; Published Date: January 2020; Publisher: Wurth Elektronik; Mounting Technology: THT; Packaging: Bag; Operating Temperature: -40 to +105degC; Part Number: 61900211121; Gender: Male; Type: Vertical
Q1 Q2 = CMP-65434-000005-1: OPTOISOLATOR 5KV TRANS 4SMD; Reverse Breakdown Voltage: 6V; Output Current per Channel: 30mA; Power Dissipation: 200mW; Collector-emitter Voltage-Max: 200mV; Max Output Voltage: 80V; Input Current: 50mA; Forward Voltage: 1.4V; Fall Time: 18000ns; Number of Elements: 1; Input Type: DC; Packaging: Tape and Reel; RoHS Compliant: Yes; Contact Plating: Copper; Min Operating Temperature: -30°C; Collector Emitter Saturation Voltage: 200mV; Max Input Current: 50mA; Radiation Hardening: No; Max Collector Current: 50mA; Case/Package: SMD/SMT; Mount: Surface Mount; Output Voltage: 80V; Forward Current: 50mA; Max Power Dissipation: 200mW; Collector Emitter Voltage (VCEO): 80V; Number of Channels: 1; Rise Time: 18000ns; Isolation Voltage: 5kV; Number of Pins: 4; Lead Free: Lead Free; Package Quantity: 2000; Isolation Voltage-Max: 5kV; Max Operating Temperature: 100°C
R1-R4 R6 R8 R10 R13 R16 R18 R20 R22-R26 R28 R29 R34 R37 R40-R51 R53 R55 R57 R58 R60 R62 R64 R?#1 = RES-CONST
R5 R39 = RES_Adj
R7 R?#2 = RES-CONST: 100K
R9 R11 R12 R14 R15 R17 R19 R21 R27 R30-R33 R35 R36 R38 R54 R61 = RES_1210
R52 R56 R59 R63 = RES-CONST: 10K
T3 T4 = RM_6_12-12-18-18
TP1-TP44 = TP_PCB?: Test_Point
U1 = CMP-1310-00291-2: IC OPAMP GP 2 CIRCUIT 8SOIC; Gain Bandwidth Product: 1MHz; Number of Circuits: 2; Min Supply Voltage: 3V; Slew Rate: 0.6V/µs; Max Dual Supply Voltage: 16V; Common Mode Rejection Ratio: 65dB; Input Bias Current: 250nA; Min Dual Supply Voltage: 1.5V; Dual Supply Voltage: 9V; Operating Supply Current: 1.5mA; Output Current: 40mA; Input Offset Voltage (Vos): 7mV; Nominal Supply Current: 1.2mA; Voltage Gain: 100dB; Max Supply Voltage: 32V; Width: 4mm; Number of Pins: 8; Min Operating Temperature: 0°C; REACH SVHC: No SVHC; Contact Plating: Tin; Lead Free: Lead Free; Halogen Free: Halogen Free; Power Supply Rejection Ratio (PSRR): 65dB; Operating Supply Voltage: 16V; Package Quantity: 2500; Max Operating Temperature: 70°C; Case/Package: SOIC; Height: 1.5mm; Packaging: Tape and Reel; Radiation Hardening: No; Number of Channels: 2; Bandwidth: 1MHz; Length: 5mm; Number of Elements: 2; Number of Amplifiers: 2; Output Current per Channel: 40mA
U2 = TL431_SOT-23-3
VD1 = ZENER
VD2-VD7 VD9 VD11-VD13 = MUR4060
VT13 VT15 VT17 VT19 = BD139
VT14 VT16 VT18 VT20 = BD140